# Altium project ISL6236_RevA.PrjPcb
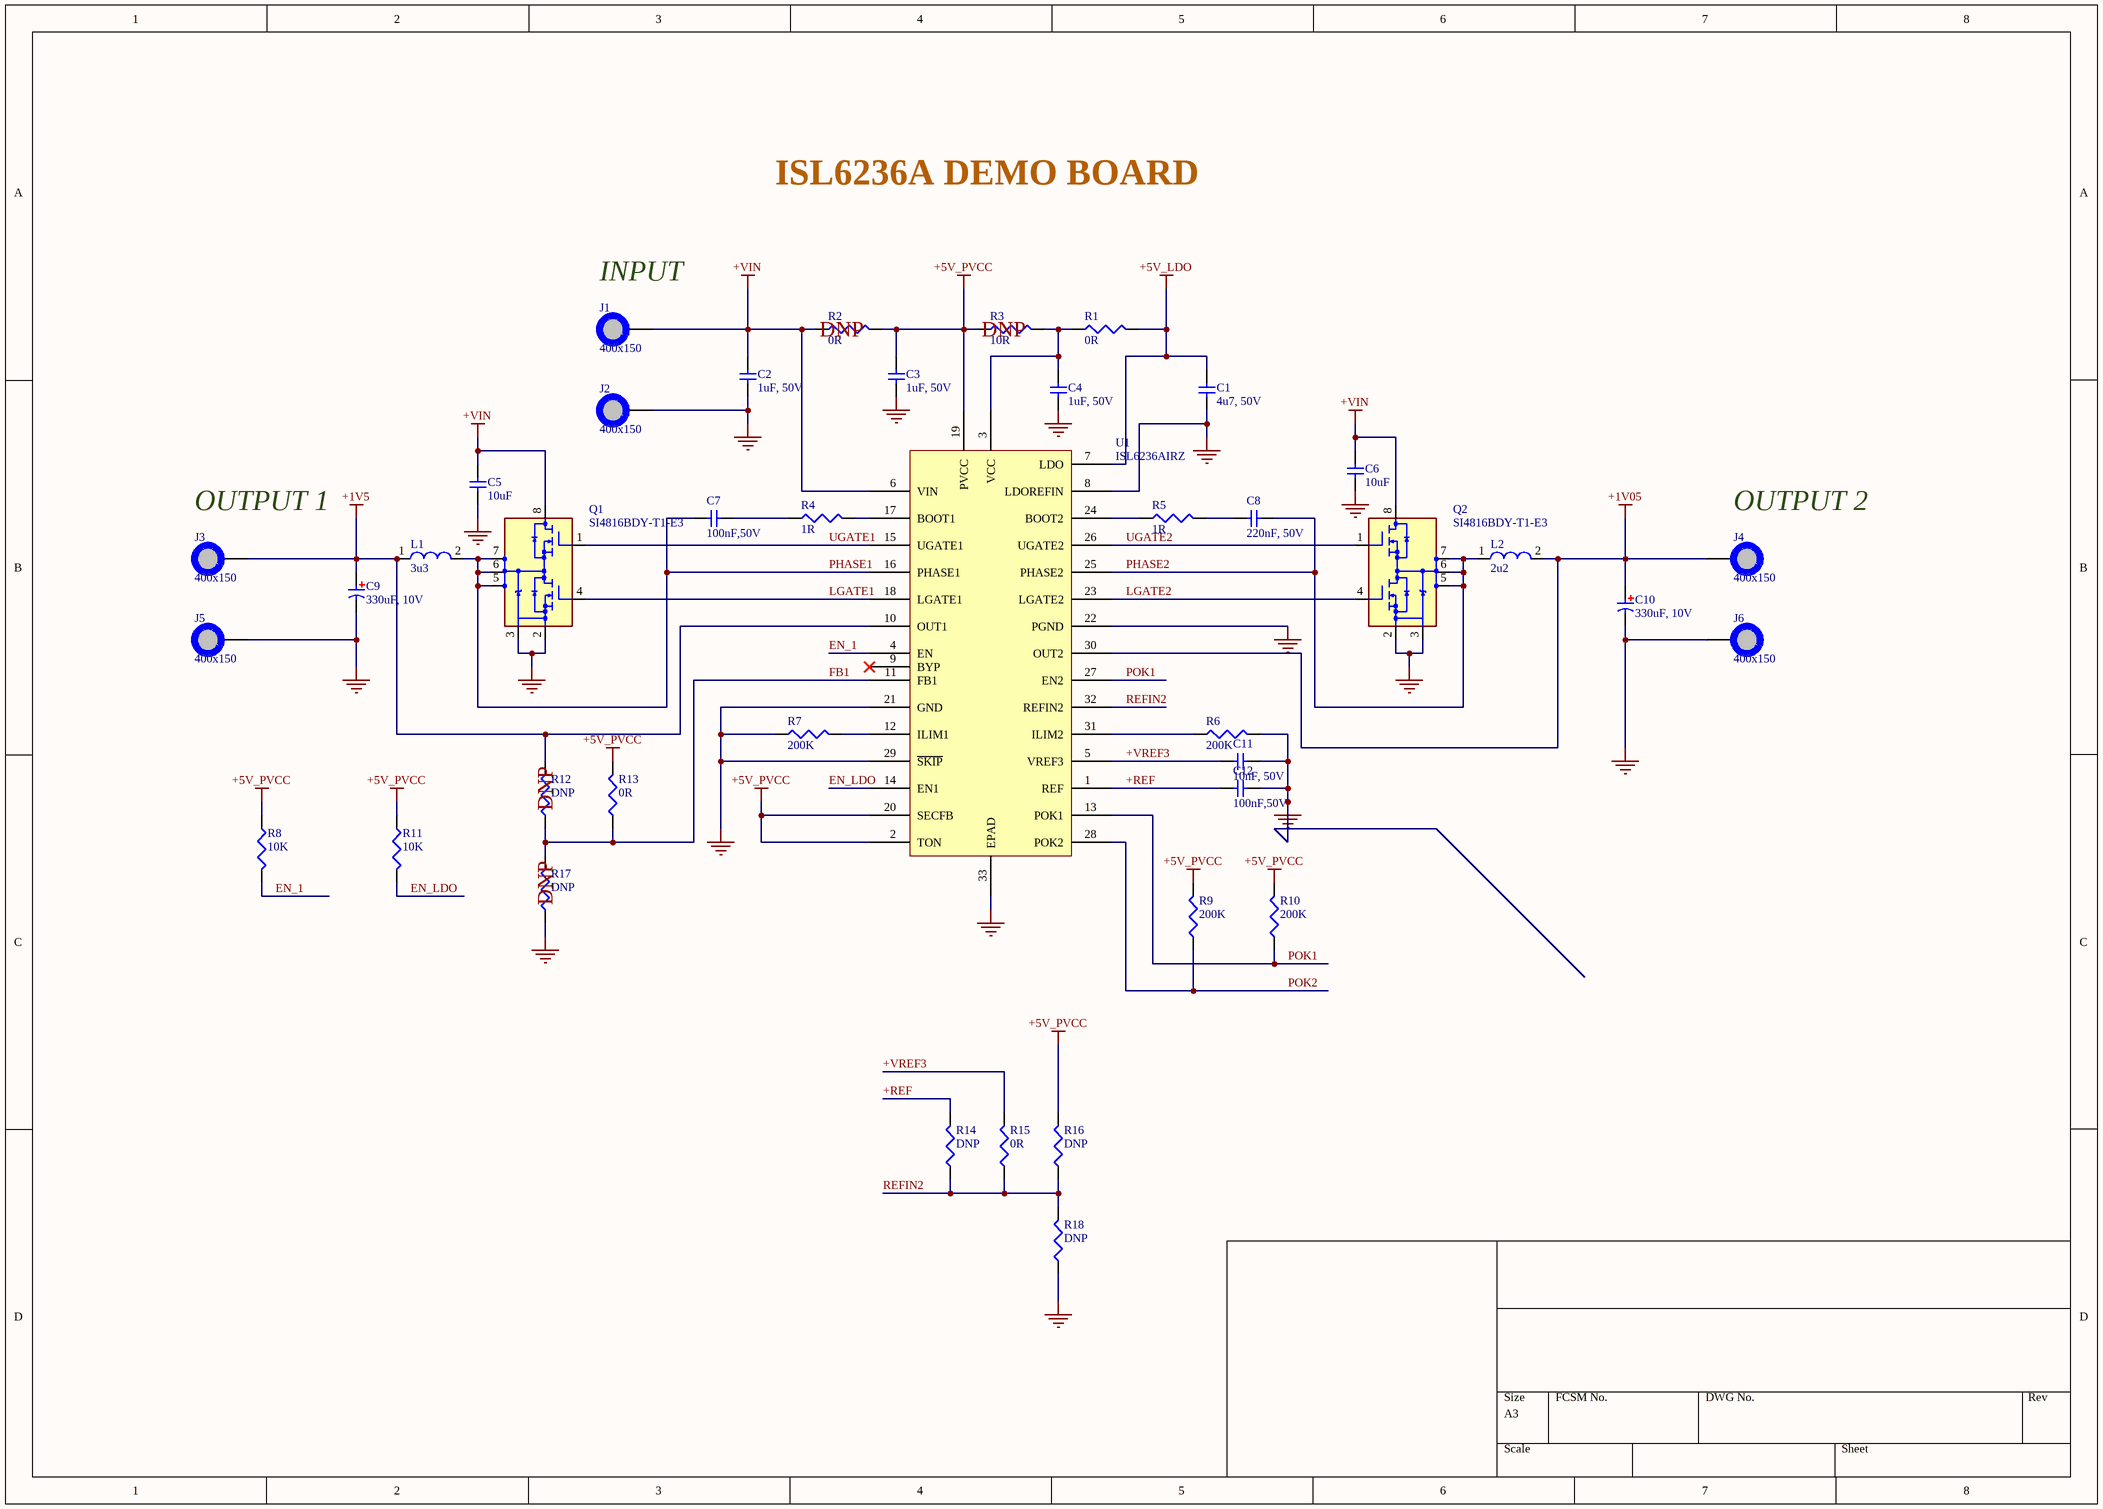
[diagram p0: Sheet1.SchDoc]
1 sheet, 41 parts. Net scope: global (net labels, ports and power ports of the same name join across sheets).
Board file: Sheet1.PcbDoc

## Sheet Sheet1.SchDoc
size A3; SheetNumber: 1; SheetTotal: 1

### Parts
C1  4u7, 50V  [C1206]
C2  1uF, 50V  [C0805]
C3  1uF, 50V  [C0805]
C4  1uF, 50V  [C0805]
C5  10uF  [C1210]
C6  10uF  [C1210]
C7  100nF,50V  [C0805]
C8  220nF, 50V  [C0805]
C9  330uF, 10V  [7343-43]
C10  330uF, 10V  [7343-43]
C11  10nF, 50V  [C0805]
C12  100nF,50V  [C0805]
J1  400x150  [PAD_400x150]
J2  400x150  [PAD_400x150]
J3  400x150  [PAD_400x150]
J4  400x150  [PAD_400x150]
J5  400x150  [PAD_400x150]
J6  400x150  [PAD_400x150]
L1  3u3  [DR125]
L2  2u2  [DR125]
Q1  SI4816BDY-T1-E3  [SO-8]
Q2  SI4816BDY-T1-E3  [SO-8]
R1  0R  [R0805]
R2  0R  [R0805]
R3  10R  [R0805]
R4  1R  [R0805]
R5  1R  [R0805]
R6  200K  [R0805]
R7  200K  [R0805]
R8  10K  [R0805]
R9  200K  [R0805]
R10  200K  [R0805]
R11  10K  [R0805]
R12  DNP  [R0805]
R13  0R  [R0805]
R14  DNP  [R0805]
R15  0R  [R0805]
R16  DNP  [R0805]
R17  DNP  [R0805]
R18  DNP  [R0805]
U1  ISL6236AIRZ  [L32.5X5B]

### Nets
+1V5: C9.1 J3.1 L1.1 R12.2 U1.10(OUT1)
+1V05: C10.1 J4.1 L2.2 U1.30(OUT2)
+5V_LDO: C1.2 R1.2 U1.7(LDO)
+5V_PVCC: C3.2 R2.2 R3.1 R8.1 R9.2 R10.2 R11.1 R13.2 R16.2 U1.2(TON) U1.19(PVCC) U1.20(SECFB)
+VIN: C2.2 C5.2 C6.2 J1.1 Q1.8(D1) Q2.8(D1) R2.1 U1.6(VIN)
GND: C1.1 C2.1 C3.1 C4.1 C5.1 C6.1 C9.2 C10.2 C11.2 C12.2 J2.1 J5.1 J6.1 Q1.2(A/S2) Q1.3(A/S2) Q2.2(A/S2) Q2.3(A/S2) R6.2 R7.1 R17.1 R18.1 U1.8(LDOREFIN) U1.21(GND) U1.22(PGND) U1.29(~{SKIP}) U1.33(EPAD)
+REF: C12.1 R14.2 U1.1(REF)
+VREF3: C11.1 R15.2 U1.5(VREF3)
EN_1: R8.2 U1.4(EN)
EN_LDO: R11.2 U1.14(EN1)
FB1: R12.1 R13.1 R17.2 U1.11(FB1)
LGATE1: Q1.4(G2) U1.18(LGATE1)
LGATE2: Q2.4(G2) U1.23(LGATE2)
PHASE1: C7.1 L1.2 Q1.5(D2/S1) Q1.6(D2/S1) Q1.7(D2/S1) U1.16(PHASE1)
PHASE2: C8.1 L2.1 Q2.5(D2/S1) Q2.6(D2/S1) Q2.7(D2/S1) U1.25(PHASE2)
POK1: R10.1 U1.13(POK1) U1.27(EN2)
POK2: R9.1 U1.28(POK2)
REFIN2: R14.1 R15.1 R16.1 R18.2 U1.32(REFIN2)
UGATE1: Q1.1(G1) U1.15(UGATE1)
UGATE2: Q2.1(G1) U1.26(UGATE2)
NetC4_2: C4.2 R1.1 R3.2 U1.3(VCC)
NetC7_2: C7.2 R4.1
NetC8_2: C8.2 R5.2
NetR4_2: R4.2 U1.17(BOOT1)
NetR5_1: R5.1 U1.24(BOOT2)
NetR6_1: R6.1 U1.31(ILIM2)
NetR7_2: R7.2 U1.12(ILIM1)

Not connected (* = marked no-connect by the designer): U1 9(BYP)*

### Notes on the sheet
- ISL6236A DEMO BOARD
- (near J1) INPUT
- (near R2) DNP
- (near R3) DNP
- (near J3) OUTPUT 1
- (near J4) OUTPUT 2
- (near R12) DNP
- (near R17) DNP

### Library data of the parts
C1 = C3216X5R1H475K160AB: C Series 1206 4.7 uF 50 V ±10 % Tolerance X5R SMT Multilayer Ceramic Capacitor; Manufacturer: TDK; Value: 4.7uF; Tolerance: 10%; Supplier: Digikey; Supplier Part Number: 445-5994-1-ND; Manufacturer Part Number: C3216X5R1H475K160AB; RoHS: Yes; Category: Ceramic Capacitors; Stock: 60492; Pricing: 1=0.73, 10=0.514, 50=0.4326, 100=0.3523, 500=0.29356, 1000=0.2472 (USD); Mounting Technology: Surface Mount; Case/Package: 1206; Case Code (Imperial): 1206; Case Code (Metric): 3216; Weight: 0.000571oz; Dielectric Material: Ceramic; Min Operating Temperature: -55°C; Max Operating Temperature: 85°C; Packaging: Tape and Reel; Voltage Rating: 50V; Voltage Rating (DC): 50V; Package Quantity: 2000; Dielectric: X5R; Termination: SMD/SMT; Series: C; Construction: Flat; Length: 3.2mm; Width: 1.6mm; Height: 1.6mm; Depth: 1.6mm; Lead Free: Lead Free; RoHS Compliant: Yes; ComponentLink1URL: https://datasheet.ciiva.com/24216/c3216x5r1h475k160ab-265269-24216325.pdf?src-supplier=Mouser; ComponentLink1Description: https://datasheet.ciiva.com/24216/c3216x5r1h475k160ab-265269-24216325.pdf?src-supplier=Mouser; ComponentLink2URL: https://datasheet.ciiva.com/6286/tdkmlcccaprange-6286230.pdf?src-supplier=Digikey; ComponentLink2Description: https://datasheet.ciiva.com/6286/tdkmlcccaprange-6286230.pdf?src-supplier=Digikey; ComponentLink3URL: https://datasheet.ciiva.com/6286/tdkmlcccaprange-6286233.pdf?src-supplier=Digikey; ComponentLink3Description: https://datasheet.ciiva.com/6286/tdkmlcccaprange-6286233.pdf?src-supplier=Digikey; ComponentLink4URL: https://datasheet.ciiva.com/6286/tdkmlcccaprange-6286236.pdf?src-supplier=Digikey; ComponentLink4Description: https://datasheet.ciiva.com/6286/tdkmlcccaprange-6286236.pdf?src-supplier=Digikey
C2-C4 = C0805C105K5RACTU: Multilayer Ceramic Capacitor, 1 uF, 50 V, ± 10%, X7R, 0805 [2012 Metric]; Manufacturer: KEMET; Supplier: Digikey; Supplier Part Number: 399-C0805C105K5RAC7800CT-ND; Manufacturer Part Number: C0805C105K5RACTU; RoHS: Yes; Category: Ceramic Capacitors; Stock: 63564; Pricing: 1=0.35, 10=0.231, 50=0.1704, 100=0.1387, 500=0.10954, 1000=0.0925 (USD); Mounting Technology: Surface Mount,PCB; Case/Package: 0805; Case Code (Metric): 2012; Case Code (Imperial): 0805; Dielectric Material: Ceramic; Min Operating Temperature: -55°C; Max Operating Temperature: 125°C; Packaging: Tape and Reel; Value: 1uF; Tolerance: 10%; Voltage Rating: 50V; Voltage Rating (DC): 50V; Package Quantity: 1; Dielectric: X7R; Termination: SMD/SMT; Voltage: 50V; Series: C; Construction: Flat; Length: 2mm; Width: 0.049inch; Height: 1.25mm; Thickness: 0.055inch; Depth: 1.25mm; Reach SVHC Compliant: No; RoHS Compliant: Yes; ComponentLink1URL: https://datasheet.ciiva.com/7842/1732744-7842192.pdf?src-supplier=Element14; ComponentLink1Description: https://datasheet.ciiva.com/7842/1732744-7842192.pdf?src-supplier=Element14; ComponentLink2URL: https://datasheet.ciiva.com/5408/kem-c1002-x7r-smd-5408569.pdf?src-supplier=Mouser; ComponentLink2Description: https://datasheet.ciiva.com/5408/kem-c1002-x7r-smd-5408569.pdf?src-supplier=Mouser
C5 C6 = C1210C106K6PACTU: Multilayer Ceramic Capacitor, 10 uF, 35 V, ± 10%, X5R, 1210 [3225 Metric]; Manufacturer: KEMET; Voltage Rating: 35V; Dissipation Factor: 2.5%; Supplier: Digikey; Supplier Part Number: 399-12070-1-ND; Manufacturer Part Number: C1210C106K6PACTU; RoHS: Yes; Category: Ceramic Capacitors; Stock: 29464; Pricing: 1=0.72, 10=0.503, 50=0.424, 100=0.3452, 500=0.28766 (USD); Mounting Technology: Surface Mount; Case/Package: 1210; Case Code (Metric): 3225; Case Code (Imperial): 1210; Dielectric Material: Ceramic; Min Operating Temperature: -55°C; Max Operating Temperature: 85°C; Packaging: Cut Tape; Value: 10uF; Voltage: 35V; Dielectric: X5R; Termination: Solder; Tolerance: 10%; Series: SMD Comm X5R; Voltage Rating (DC): 35V; Length: 3.2mm; Height: 1.9mm; Depth: 2.5mm; RoHS Compliant: Yes; Lead Free: 5697LeadFree; ComponentLink1URL: http://www.farnell.com/datasheets/2741192.pdf?src-supplier=Farnell; ComponentLink1Description: http://www.farnell.com/datasheets/2741192.pdf?src-supplier=Farnell; ComponentLink2URL: http://www.alliedelec.com/m/d/f3c02ddb98afa3dd1adcb801109671e9.pdf?src-supplier=Allied+Electronics; ComponentLink2Description: http://www.alliedelec.com/m/d/f3c02ddb98afa3dd1adcb801109671e9.pdf?src-supplier=Allied+Electronics; ComponentLink3URL: https://datasheet.octopart.com/C1210C106K6PACTU-KEMET-datasheet-83562113.pdf?src-supplier=Newark; ComponentLink3Description: https://datasheet.octopart.com/C1210C106K6PACTU-KEMET-datasheet-83562113.pdf?src-supplier=Newark; ComponentLink4URL: http://www.farnell.com/datasheets/2741192.pdf?src-supplier=Newark; ComponentLink4Description: http://www.farnell.com/datasheets/2741192.pdf?src-supplier=Newark; ComponentLink5URL: https://datasheet.octopart.com/C1210C106K6PACTU-KEMET-datasheet-86448939.pdf?src-supplier=Farnell; ComponentLink5Description: https://datasheet.octopart.com/C1210C106K6PACTU-KEMET-datasheet-86448939.pdf?src-supplier=Farnell; ComponentLink6URL: https://api.kemet.com/component-edge/download/datasheet/C1210C106K6PAC7800.pdf?src-supplier=Digikey; ComponentLink6Description: https://api.kemet.com/component-edge/download/datasheet/C1210C106K6PAC7800.pdf?src-supplier=Digikey; ComponentLink7URL: http://www.kemet.com/docfinder?Partnumber=C1210C106K6PAC7800&src-supplier=Digikey; ComponentLink7Description: http://www.kemet.com/docfinder?Partnumber=C1210C106K6PAC7800&src-supplier=Digikey; ComponentLink8URL: https://datasheet.octopart.com/C1210C106K6PACTU-KEMET-datasheet-130260269.pdf?src-supplier=TME; ComponentLink8Description: https://datasheet.octopart.com/C1210C106K6PACTU-KEMET-datasheet-130260269.pdf?src-supplier=TME
C7 C12 = C0805C104K5RACTU: Multilayer Ceramic Capacitor, 0.1 uF, 50 V, ± 10%, X7R, 0805 [2012 Metric]; Manufacturer: KEMET; Material: 4241ConductorMaterial; Voltage: 500V; Temperature Coefficient: 30ppm/°C; Supplier: Digikey; Supplier Part Number: 399-C0805C104K5RAC7800CT-ND; Manufacturer Part Number: C0805C104K5RACTU; RoHS: Yes; Category: Ceramic Capacitors; Stock: 3522424; Pricing: 1=0.14, 10=0.091, 50=0.0546, 100=0.043, 500=0.03172, 1000=0.02627 (USD); Mounting Technology: Surface Mount,PCB; Case/Package: 0805; Pins: 2; Case Code (Imperial): 0805; Case Code (Metric): 2012; Min Operating Temperature: -55°C; Max Operating Temperature: 125°C; Value: 100nF; Package Quantity: 4000; Voltage Rating: 50V; Tolerance: 10%; Packaging: Tape and Reel; Voltage Rating (DC): 50V; Dielectric: X7R; Termination: SMD/SMT; Series: SMD Comm X7R; Construction: Flat; Length: 2mm; Width: 1.2mm; Height: 0.9mm; Lead Pitch: 0.75mm; Depth: 1.25mm; Radiation Hardening: No; Reach SVHC Compliant: No; RoHS Compliant: Yes; Lead Free: 5697LeadFree
C8 = C0805C224K5RACTU: Multilayer Ceramic Capacitor, 0.22 uF, 50 V, ± 10%, X7R, 0805 [2012 Metric]; Manufacturer: KEMET; Material: 4241ConductorMaterial; Dissipation Factor: 2.5%; Temperature Coefficient: 30ppm/°C; Supplier: Digikey; Supplier Part Number: 399-C0805C224K5RACTUCT-ND; Manufacturer Part Number: C0805C224K5RACTU; RoHS: Yes; Category: Ceramic Capacitors; Stock: 582244; Pricing: 1=0.16, 10=0.106, 50=0.063, 100=0.0496, 500=0.03666, 1000=0.03035 (USD); Mounting Technology: Surface Mount,PCB; Case/Package: 0805; Case Code (Metric): 2012; Case Code (Imperial): 0805; Dielectric Material: Ceramic; Min Operating Temperature: -55°C; Max Operating Temperature: 125°C; Package Quantity: 4000; Value: 220nF; Voltage Rating: 50V; Tolerance: 10%; Packaging: Tape and Reel; Voltage Rating (DC): 50V; Dielectric: X7R; Termination: SMD/SMT; Voltage: 50V; Series: SMD Comm X7R; Construction: Flat; Length: 2mm; Width: 1.2mm; Height: 1.1mm; Lead Pitch: 0.75mm; Depth: 1.25mm; Radiation Hardening: No; Reach SVHC Compliant: No; RoHS Compliant: Yes; Lead Free: 5697LeadFree; ComponentLink1URL: https://datasheet.ciiva.com/7842/kem-c1002-x7r-smd-7842582.pdf?src-supplier=Element14; ComponentLink1Description: https://datasheet.ciiva.com/7842/kem-c1002-x7r-smd-7842582.pdf?src-supplier=Element14; ComponentLink2URL: https://datasheet.ciiva.com/28682/1851736-28682316.pdf?src-supplier=Element14; ComponentLink2Description: https://datasheet.ciiva.com/28682/1851736-28682316.pdf?src-supplier=Element14; ComponentLink3URL: https://datasheet.ciiva.com/14589/70095383-14589519.pdf?src-supplier=Allied+Electronics; ComponentLink3Description: https://datasheet.ciiva.com/14589/70095383-14589519.pdf?src-supplier=Allied+Electronics; ComponentLink4URL: https://datasheet.ciiva.com/14603/70095383-14603247.pdf?src-supplier=Allied+Electronics; ComponentLink4Description: https://datasheet.ciiva.com/14603/70095383-14603247.pdf?src-supplier=Allied+Electronics
C9 C10 = T530X337M010ATE004: Cap Tant Solid 330uF 10V X CASE 20% (7.3 X 4.3 X 4mm) SMD 7343-43 0.004 Ohm 125 C T/R; Manufacturer: KEMET; Ripple Current: 8.2A; ESR (Equivalent Series Resistance): 4mR; Leakage Current: 330uA; Polarity: Polar; Dissipation Factor: 8%; Supplier: Digikey; Supplier Part Number: 399-10378-1-ND; Manufacturer Part Number: T530X337M010ATE004; RoHS: Yes; Category: Polymer Capacitors; Stock: 351; Pricing: 1=7.14, 10=6.191, 50=5.5562, 100=4.8259 (USD); Mounting Technology: Surface Mount,PCB; Case/Package: 2917; Case Code (Imperial): 2917; Case Code (Metric): 7343; Min Operating Temperature: -55°C; Max Operating Temperature: 125°C; Package Quantity: 500; Voltage Rating (DC): 10V; Value: 330uF; Tolerance: 20%; Packaging: Tape and Reel; Voltage Rating: 10V; Termination: SMD/SMT; Voltage: 10V; Features: General Purpose; Series: T530; Construction: Flat; Length: 7.3mm; Width: 4.3mm; Height: 4mm; Depth: 4.3mm; Reach SVHC Compliant: No; RoHS Compliant: Yes; ComponentLink1URL: https://datasheet.ciiva.com/11794/0900766b80deaa91-11794477.pdf?src-supplier=Rs; ComponentLink1Description: https://datasheet.ciiva.com/11794/0900766b80deaa91-11794477.pdf?src-supplier=Rs; ComponentLink2URL: https://datasheet.ciiva.com/14593/70096008-14593753.pdf?src-supplier=Allied+Electronics; ComponentLink2Description: https://datasheet.ciiva.com/14593/70096008-14593753.pdf?src-supplier=Allied+Electronics
C11 = C0805F103K5RACTU: 0805 C 10nF Ceramic Multilayer Capacitor; 50 VDC; +125degC; X7R Dielec; +/-10%; Manufacturer: KEMET; Tolerance: 10%; Supplier: Digikey; Supplier Part Number: 399-C0805F103K5RAC7800CT-ND; Manufacturer Part Number: C0805F103K5RACTU; RoHS: Yes; Category: Ceramic Capacitors; Stock: 9976; Pricing: 1=0.35, 10=0.225, 50=0.158, 100=0.1276, 500=0.09478, 1000=0.08293 (USD); Mounting Technology: Surface Mount; Case/Package: 0805; Pins: 2; Case Code (Imperial): 0805; Case Code (Metric): 2012; Min Operating Temperature: -55°C; Max Operating Temperature: 125°C; Value: 10nF; Package Quantity: 1; Voltage Rating: 50V; Voltage Rating (DC): 50V; Packaging: Cut Tape; Dielectric: X7R; Termination: SMD/SMT; Series: FO-CAP; Construction: Flat; Voltage Rating (AC): 50V; Length: 2mm; Width: 0.049inch; Height: 0.9mm; Lead Pitch: 0.75mm; Thickness: 0.039inch; Depth: 1.25mm; Reach SVHC Compliant: No; RoHS Compliant: Yes; Lead Free: 5697LeadFree; ComponentLink1URL: https://datasheet.ciiva.com/146/docfinderpartnumber-c0805f103k5ractu-146278.pdf?src-supplier=Digikey; ComponentLink1Description: https://datasheet.ciiva.com/146/docfinderpartnumber-c0805f103k5ractu-146278.pdf?src-supplier=Digikey; ComponentLink2URL: https://datasheet.ciiva.com/7842/48829-7842408.pdf?src-supplier=Element14; ComponentLink2Description: https://datasheet.ciiva.com/7842/48829-7842408.pdf?src-supplier=Element14; ComponentLink3URL: https://datasheet.ciiva.com/7842/48829-7842407.pdf?src-supplier=Element14; ComponentLink3Description: https://datasheet.ciiva.com/7842/48829-7842407.pdf?src-supplier=Element14
J1-J6 = PAD: Pad with a hole of 4mm x 1.5mm
L1 = DR125-3R3-R: Inductor Power Shielded Drum Core 3.3uH 20% 100KHz Ferrite 9.26A 6.3mOhm DCR T/R; Manufacturer: Eaton Cooper; Saturation Current: 12.7A; DC Resistance (DCR): 6.3mR; Supplier: Digikey; Supplier Part Number: 513-1529-1-ND; Manufacturer Part Number: DR125-3R3-R; RoHS: Yes; Category: Fixed Inductors; Stock: 26681; Pricing: 1=1.21, 10=1.02, 25=0.9276, 50=0.8718, 100=0.7234, 250=0.66776 (USD); Mounting Technology: Surface Mount; Case/Package: Nonstandard; Pins: 2; Core Material: Ferrite; Weight: 0.144oz; Min Operating Temperature: -40°C; Max Operating Temperature: 125°C; Current Rating: 9.26A; Tolerance: 20%; Shielding: Shielded; Packaging: Tape and Reel; Inductance Tolerance: 20%; Package Quantity: 600; Value: 3.3uH; Test Frequency: 100kHz; Max DC Current: 9.26A; Termination: SMD/SMT; RMS Current (Irms): 9.26A; Series: DR; Max Current Rating: 9.26A; Length: 12.5mm; Width: 0.492inch; Height: 6mm; Height - Seated (Max): 0.236inch; Depth: 12.5mm; Radiation Hardening: No; Reach SVHC Compliant: No; Military Standard: Not; ComponentLink1URL: https://datasheet.ciiva.com/26858/getdatasheetpartid-251124-26858392.pdf?src-supplier=Verical; ComponentLink1Description: https://datasheet.ciiva.com/26858/getdatasheetpartid-251124-26858392.pdf?src-supplier=Verical; ComponentLink2URL: https://datasheet.ciiva.com/16295/bus-elx-ds-4315-dr-series-16295562.pdf?src-supplier=Future+Electronics; ComponentLink2Description: https://datasheet.ciiva.com/16295/bus-elx-ds-4315-dr-series-16295562.pdf?src-supplier=Future+Electronics; ComponentLink3URL: https://datasheet.ciiva.com/30081/4a32919a-7470-4ae0-be45-b59e3a1351ef-30081146.pdf?src-supplier=Onlinecomponents.com; ComponentLink3Description: https://datasheet.ciiva.com/30081/4a32919a-7470-4ae0-be45-b59e3a1351ef-30081146.pdf?src-supplier=Onlinecomponents.com; ComponentLink4URL: https://datasheet.ciiva.com/5707/87246-5707962.pdf?src-supplier=Farnell; ComponentLink4Description: https://datasheet.ciiva.com/5707/87246-5707962.pdf?src-supplier=Farnell
L2 = DR125-2R2-R: Ind Power Shielded Wirewound 2.2uH 20% 100KHz Ferrite 10.9A T/R; Manufacturer: Eaton Cooper; Saturation Current: 15A; DC Resistance (DCR): 4.5mR; Supplier: Digikey; Supplier Part Number: 513-1662-1-ND; Manufacturer Part Number: DR125-2R2-R; RoHS: Yes; Category: Fixed Inductors; Stock: 2132; Pricing: 1=1.21, 10=1.02, 25=0.9276, 50=0.8718, 100=0.7234, 250=0.6678 (USD); Mounting Technology: Surface Mount; Case/Package: Nonstandard; Pins: 2; Core Material: Ferrite; Weight: 0.144oz; Min Operating Temperature: -40°C; Max Operating Temperature: 125°C; Package Quantity: 600; Current Rating: 10.9A; Tolerance: 20%; Shielding: Shielded; Packaging: Tape and Reel; Value: 2.2uH; Inductance Tolerance: 20%; Test Frequency: 100kHz; Max DC Current: 10.9A; Termination: SMD/SMT; Self Resonant Frequency: 100kHz; DC Current: 10.9A; RMS Current (Irms): 10.9A; Series: DR; Max Current Rating: 10.9A; Length: 12.5mm; Width: 0.492inch; Height: 6mm; Height - Seated (Max): 0.236inch; Depth: 12.5mm; Radiation Hardening: No; Reach SVHC Compliant: No; Military Standard: Not; Lead Free: Lead Free; RoHS Compliant: Yes; ComponentLink1URL: https://datasheet.ciiva.com/14667/0900766b8116a153-14667792.pdf?src-supplier=Rs; ComponentLink1Description: https://datasheet.ciiva.com/14667/0900766b8116a153-14667792.pdf?src-supplier=Rs; ComponentLink2URL: https://datasheet.ciiva.com/26926/getdatasheetpartid-571249-26926912.pdf?src-supplier=Verical; ComponentLink2Description: https://datasheet.ciiva.com/26926/getdatasheetpartid-571249-26926912.pdf?src-supplier=Verical; ComponentLink3URL: https://datasheet.ciiva.com/8004/87246-8004874.pdf?src-supplier=Element14; ComponentLink3Description: https://datasheet.ciiva.com/8004/87246-8004874.pdf?src-supplier=Element14
Q1 Q2 = SI4816BDY-T1-E3: Transistor MOSFET Array Dual N-CH 30V 5.8A/8.2A 8-Pin SOIC T/R; Manufacturer: Vishay Siliconix; Nominal Vgs: 3V; Rise Time: 9ns; Rds On Max: 18.5mR; Number of Elements: 2; Continuous Drain Current (ID): 8.2A; Drain to Source Resistance: 11.5mR; Gate to Source Voltage (Vgs): 20V; Max Power Dissipation: 1.25W; Turn-Off Delay Time: 31ns; Turn-On Delay Time: 13ns; Threshold Voltage: 1V; FET Type: 2 N-Channel; Polarity: N-CHANNEL; Supplier: Digikey; Supplier Part Number: SI4816BDY-T1-E3CT-ND; Manufacturer Part Number: SI4816BDY-T1-E3; RoHS: Yes; Category: MOSFETs; Stock: 1332; Pricing: 1=1.58, 10=1.311, 100=1.0438, 500=0.88324, 1000=0.74942 (USD); Mounting Technology: Surface Mount; Case/Package: SO; Pins: 8; Weight: 0.006596oz; Min Operating Temperature: -55°C; Max Operating Temperature: 150°C; Packaging: Tape and Reel; Package Quantity: 2500; Drain to Source Voltage (Vdss): 30V; Fall Time: 9ns; Number of Channels: 2; Series: LITTLE FOOT®; Drain-source On Resistance-Max: 18.5mR; Length: 5mm; Width: 4mm; Height: 1.55mm; Radiation Hardening: No; Lead Free: Lead Free; RoHS Compliant: Yes; Reach SVHC Compliant: Unknown; ComponentLink1URL: https://datasheet.ciiva.com/16486/si4816bd-16486349.pdf?src-supplier=Future+Electronics; ComponentLink1Description: https://datasheet.ciiva.com/16486/si4816bd-16486349.pdf?src-supplier=Future+Electronics
R1 R2 R13 R15 = AC0805JR-070RL: Zero Ohm Resistor, 0805 [2012 Metric], Thick Film, 125 mW, 2 A, Surface Mount; Manufacturer: Yageo; Power Rating: 125mW; Tolerance: 5%; Voltage Rating: 150V; Temperature Coefficient: 200ppm/°C; Supplier: Digikey; Supplier Part Number: YAG3755CT-ND; Manufacturer Part Number: AC0805JR-070RL; RoHS: Yes; Category: Chip SMD Resistors; Stock: 130832; Pricing: 1=0.1, 10=0.035, 25=0.0272, 50=0.0206, 100=0.0144, 250=0.0116, 500=0.00928, 1000=0.00683 (USD); Case/Package: 0805; Case Code (Imperial): 0805; Case Code (Metric): 2012; Min Operating Temperature: -55°C; Max Operating Temperature: 155°C; Packaging: Tape and Reel; Value: 0R; Termination: SMD/SMT; Number of Terminations: 2; Max Power Dissipation: 125mW; Features: Moisture Resistant,Automotive AEC-Q200; Series: AC; Length: 0.079inch; Width: 1.25mm; Height: 0.024inch; RoHS Compliant: Yes; Lead Free: 5697LeadFree; ComponentLink1URL: https://datasheet.octopart.com/AC0805JR-070RL-Yageo-datasheet-166720450.pdf?src-supplier=Future+Electronics; ComponentLink1Description: https://datasheet.octopart.com/AC0805JR-070RL-Yageo-datasheet-166720450.pdf?src-supplier=Future+Electronics; ComponentLink2URL: http://www.yageo.com/documents/recent/PYu-AC_51_RoHS_L_2.pdf?src-supplier=Mouser; ComponentLink2Description: http://www.yageo.com/documents/recent/PYu-AC_51_RoHS_L_2.pdf?src-supplier=Mouser
R3 = AC0805FR-0710RL: SMD Chip Resistor, 10 Ohm, ± 1%, 125 mW, 0805 [2012 Metric], Thick Film, General Purpose; Manufacturer: Yageo; Power Rating: 125mW; Voltage Rating: 150V; Temperature Coefficient: 200ppm/°C; Supplier: Digikey; Supplier Part Number: YAG3690CT-ND; Manufacturer Part Number: AC0805FR-0710RL; RoHS: Yes; Category: Chip SMD Resistors; Stock: 169764; Pricing: 1=0.11, 10=0.052, 50=0.0338, 100=0.0286, 500=0.02014, 1000=0.01754 (USD); Case/Package: 0805; Case Code (Imperial): 0805; Case Code (Metric): 2012; Min Operating Temperature: -55°C; Max Operating Temperature: 155°C; Packaging: Tape and Reel; Value: 10R; Tolerance: 1%; Termination: SMD/SMT; Number of Terminations: 2; Max Power Dissipation: 125mW; Features: Moisture Resistant,Automotive AEC-Q200; Series: AC; Length: 0.079inch; Width: 1.25mm; Height: 0.024inch; Lead Free: Lead Free; RoHS Compliant: Yes; ComponentLink1URL: http://www.mouser.com/ds/2/447/yageodocoutput-1111992.pdf?src-supplier=Mouser; ComponentLink1Description: http://www.mouser.com/ds/2/447/yageodocoutput-1111992.pdf?src-supplier=Mouser; ComponentLink2URL: https://www.yageo.com/upload/media/product/productsearch/datasheet/rchip/PYu-AC_51_RoHS_L_7.pdf?src-supplier=Digikey; ComponentLink2Description: https://www.yageo.com/upload/media/product/productsearch/datasheet/rchip/PYu-AC_51_RoHS_L_7.pdf?src-supplier=Digikey; ComponentLink3URL: http://www.yageo.com/NewPortal/yageodocoutput?fileName=/pdf/R-Chip/PYu-AC_51_RoHS_L_6.pdf&src-supplier=Digikey; ComponentLink3Description: http://www.yageo.com/NewPortal/yageodocoutput?fileName=/pdf/R-Chip/PYu-AC_51_RoHS_L_6.pdf&src-supplier=Digikey; ComponentLink4URL: https://datasheet.octopart.com/AC0805FR-0710RL-Yageo-datasheet-151884373.pdf?src-supplier=Future+Electronics; ComponentLink4Description: https://datasheet.octopart.com/AC0805FR-0710RL-Yageo-datasheet-151884373.pdf?src-supplier=Future+Electronics; ComponentLink5URL: http://www.yageo.com/documents/recent/PYu-AC_51_RoHS_L_2_revised.pdf?src-supplier=Future+Electronics; ComponentLink5Description: http://www.yageo.com/documents/recent/PYu-AC_51_RoHS_L_2_revised.pdf?src-supplier=Future+Electronics
R4 R5 = AC0805FR-071RL: SMD Chip Resistor, 1 Ohm, ± 1%, 125 mW, 0805 [2012 Metric], Thick Film, General Purpose; Manufacturer: Yageo; Voltage Rating: 150V; Power Rating: 125mW; Temperature Coefficient: 200ppm/°C; Supplier: Digikey; Supplier Part Number: YAG3705CT-ND; Manufacturer Part Number: AC0805FR-071RL; RoHS: Yes; Category: Chip SMD Resistors; Stock: 72108; Pricing: 1=0.11, 10=0.052, 50=0.0338, 100=0.0286, 500=0.02014, 1000=0.01754 (USD); Case/Package: 0805; Case Code (Imperial): 0805; Case Code (Metric): 2012; Weight: 0.000194oz; Min Operating Temperature: -55°C; Max Operating Temperature: 155°C; Packaging: Tape and Reel; Tolerance: 1%; Value: 1R; Number of Terminations: 2; Termination: SMD/SMT; Max Power Dissipation: 125mW; Features: Moisture Resistant,Automotive AEC-Q200; Series: AC; Length: 0.079inch; Width: 1.25mm; Height: 0.024inch; Lead Free: Lead Free; RoHS Compliant: Yes; ComponentLink1URL: https://datasheet.ciiva.com/12576/pyu-ac-51-rohs-l-2-12576553.pdf?src-supplier=Mouser; ComponentLink1Description: https://datasheet.ciiva.com/12576/pyu-ac-51-rohs-l-2-12576553.pdf?src-supplier=Mouser
R6 R7 R9 R10 = AC0805FR-07200KL: SMD Chip Resistor, 200 kOhm, ± 1%, 125 mW, 0805 [2012 Metric], Thick Film, General Purpose; Manufacturer: Yageo; Power Rating: 125mW; Value: 200kR; Voltage Rating: 150V; Temperature Coefficient: 100ppm/°C; Supplier: Digikey; Supplier Part Number: YAG3706CT-ND; Manufacturer Part Number: AC0805FR-07200KL; RoHS: Yes; Category: Chip SMD Resistors; Stock: 311; Pricing: 1=0.1, 10=0.031, 50=0.0198, 100=0.0166, 500=0.01152, 1000=0.00997 (USD); Case Code (Imperial): 0805; Case Code (Metric): 2012; Weight: 0.000194oz; Min Operating Temperature: -55°C; Max Operating Temperature: 155°C; Tolerance: 1%; Packaging: Cut Tape; Termination: SMD/SMT; Series: AC; Technology: THICK FILM; Package Quantity: 5000; Length: 2mm; Width: 1.25mm; Height: 0.5mm; Lead Free: Lead Free; RoHS Compliant: Yes; ComponentLink1URL: http://www.mouser.com/ds/2/447/yageodocoutput-1111992.pdf?src-supplier=Mouser; ComponentLink1Description: http://www.mouser.com/ds/2/447/yageodocoutput-1111992.pdf?src-supplier=Mouser; ComponentLink2URL: http://www.yageo.com/documents/recent/PYu-AC_51_RoHS_L_2.pdf?src-supplier=Future+Electronics; ComponentLink2Description: http://www.yageo.com/documents/recent/PYu-AC_51_RoHS_L_2.pdf?src-supplier=Future+Electronics; ComponentLink3URL: https://datasheet.octopart.com/AC0805FR-07200KL-Yageo-datasheet-151884373.pdf?src-supplier=Future+Electronics; ComponentLink3Description: https://datasheet.octopart.com/AC0805FR-07200KL-Yageo-datasheet-151884373.pdf?src-supplier=Future+Electronics; ComponentLink4URL: http://www.yageo.com/NewPortal/yageodocoutput?fileName=/pdf/R-Chip/PYu-AC_51_RoHS_L_6.pdf&src-supplier=Digikey; ComponentLink4Description: http://www.yageo.com/NewPortal/yageodocoutput?fileName=/pdf/R-Chip/PYu-AC_51_RoHS_L_6.pdf&src-supplier=Digikey
R8 R11 = AC0805FR-0710KL: Res Thick Film 0805 10K Ohm 1% 0.125W(1/8W) ±100ppm/C Pad SMD Automotive T/R; Manufacturer: Yageo; Value: 10kR; Power Rating: 125mW; Voltage Rating: 150V; Temperature Coefficient: 100ppm/°C; Supplier: Digikey; Supplier Part Number: 311-10KLGCT-ND; Manufacturer Part Number: AC0805FR-0710KL; RoHS: Yes; Category: Chip SMD Resistors; Stock: 458520; Pricing: 1=0.1, 10=0.031, 50=0.0198, 100=0.0166, 500=0.01152, 1000=0.00997 (USD); Case/Package: 0805; Case Code (Metric): 2012; Case Code (Imperial): 0805; Min Operating Temperature: -55°C; Max Operating Temperature: 155°C; Packaging: Tape and Reel; Tolerance: 1%; Package Quantity: 1; Number of Terminations: 2; Termination: SMD/SMT; Max Power Dissipation: 125mW; Features: Moisture Resistant,Automotive AEC-Q200,Anti-Sulfur; Series: AC; Construction: Rectangular; Length: 0.079inch; Width: 0.049inch; Height: 0.024inch; Depth: 1.25mm; Military Standard: Not; Lead Free: Lead Free; RoHS Compliant: Yes; ComponentLink1URL: http://www.yageo.com/NewPortal/yageodocoutput?fileName=/pdf/R-Chip/PYu-AC_51_RoHS_L_6.pdf&src-supplier=Digikey; ComponentLink1Description: http://www.yageo.com/NewPortal/yageodocoutput?fileName=/pdf/R-Chip/PYu-AC_51_RoHS_L_6.pdf&src-supplier=Digikey; ComponentLink2URL: http://www.yageo.com/documents/recent/PYu-AC_51_RoHS_L_2_revised.pdf?src-supplier=Future+Electronics; ComponentLink2Description: http://www.yageo.com/documents/recent/PYu-AC_51_RoHS_L_2_revised.pdf?src-supplier=Future+Electronics; ComponentLink3URL: http://www.yageo.com/NewPortal/yageodocoutput?fileName=/pdf/R-Chip/PYu-AC_51_RoHS_L_6.pdf&src-supplier=NAC+Semi; ComponentLink3Description: http://www.yageo.com/NewPortal/yageodocoutput?fileName=/pdf/R-Chip/PYu-AC_51_RoHS_L_6.pdf&src-supplier=NAC+Semi; ComponentLink4URL: http://www.yageo.com/NewPortal/yageodocoutput?fileName=/pdf/R-Chip/PYu-AC_51_RoHS_L_6.pdf&src-supplier=Rutronik; ComponentLink4Description: http://www.yageo.com/NewPortal/yageodocoutput?fileName=/pdf/R-Chip/PYu-AC_51_RoHS_L_6.pdf&src-supplier=Rutronik
R12 R14 R16-R18 = RES
U1 = ISL6236AIRZ: Soft Sw PWM Cntrlr 2-OUT Power Supply Controller 200KHz/300KHz/400KHz/500KHz 32-Pin QFN EP; Manufacturer: Renesas; Frequency: 500kHz; Output Voltage: 5.5V; Supplier: Digikey; Supplier Part Number: ISL6236AIRZ-ND; Stock: 1323; Pricing: 1=6.37, 10=5.754, 25=5.4868, 80=4.76413, 230=4.55004, 490=4.14857, 980=3.61328, 2450=3.47945 (USD); ComponentLink1URL: https://datasheet.octopart.com/ISL6236AIRZ-Renesas-datasheet-138160199.pdf?src-supplier=Future+Electronics; ComponentLink1Description: https://datasheet.octopart.com/ISL6236AIRZ-Renesas-datasheet-138160199.pdf?src-supplier=Future+Electronics; ComponentLink2URL: http://www.intersil.com/content/dam/Intersil/documents/isl6/isl6236a.pdf?src-supplier=Digikey; ComponentLink2Description: http://www.intersil.com/content/dam/Intersil/documents/isl6/isl6236a.pdf?src-supplier=Digikey; Manufacturer Part Number: ISL6236AIRZ; RoHS: Yes